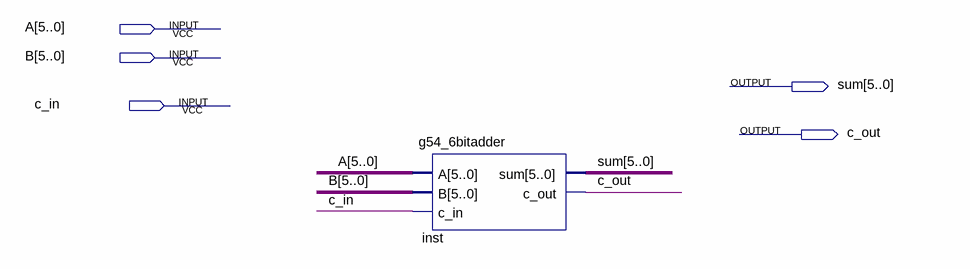
[diagram p0: schematic sheet]
// Quartus schematic g54_6bitadderBLOCK.bdf as structural Verilog: 1 symbols, 5 pins
module g54_6bitadderBLOCK (
  input  [5:0] A,
  input  [5:0] B,
  input  c_in,
  output [5:0] sum,
  output c_out
);

  g54_6bitadder inst (.A(A), .B(B), .c_in(c_in), .sum(sum), .c_out(c_out));
endmodule
